# EAGLE schematic unoshield-v3 (EAGLE 8.7.1)
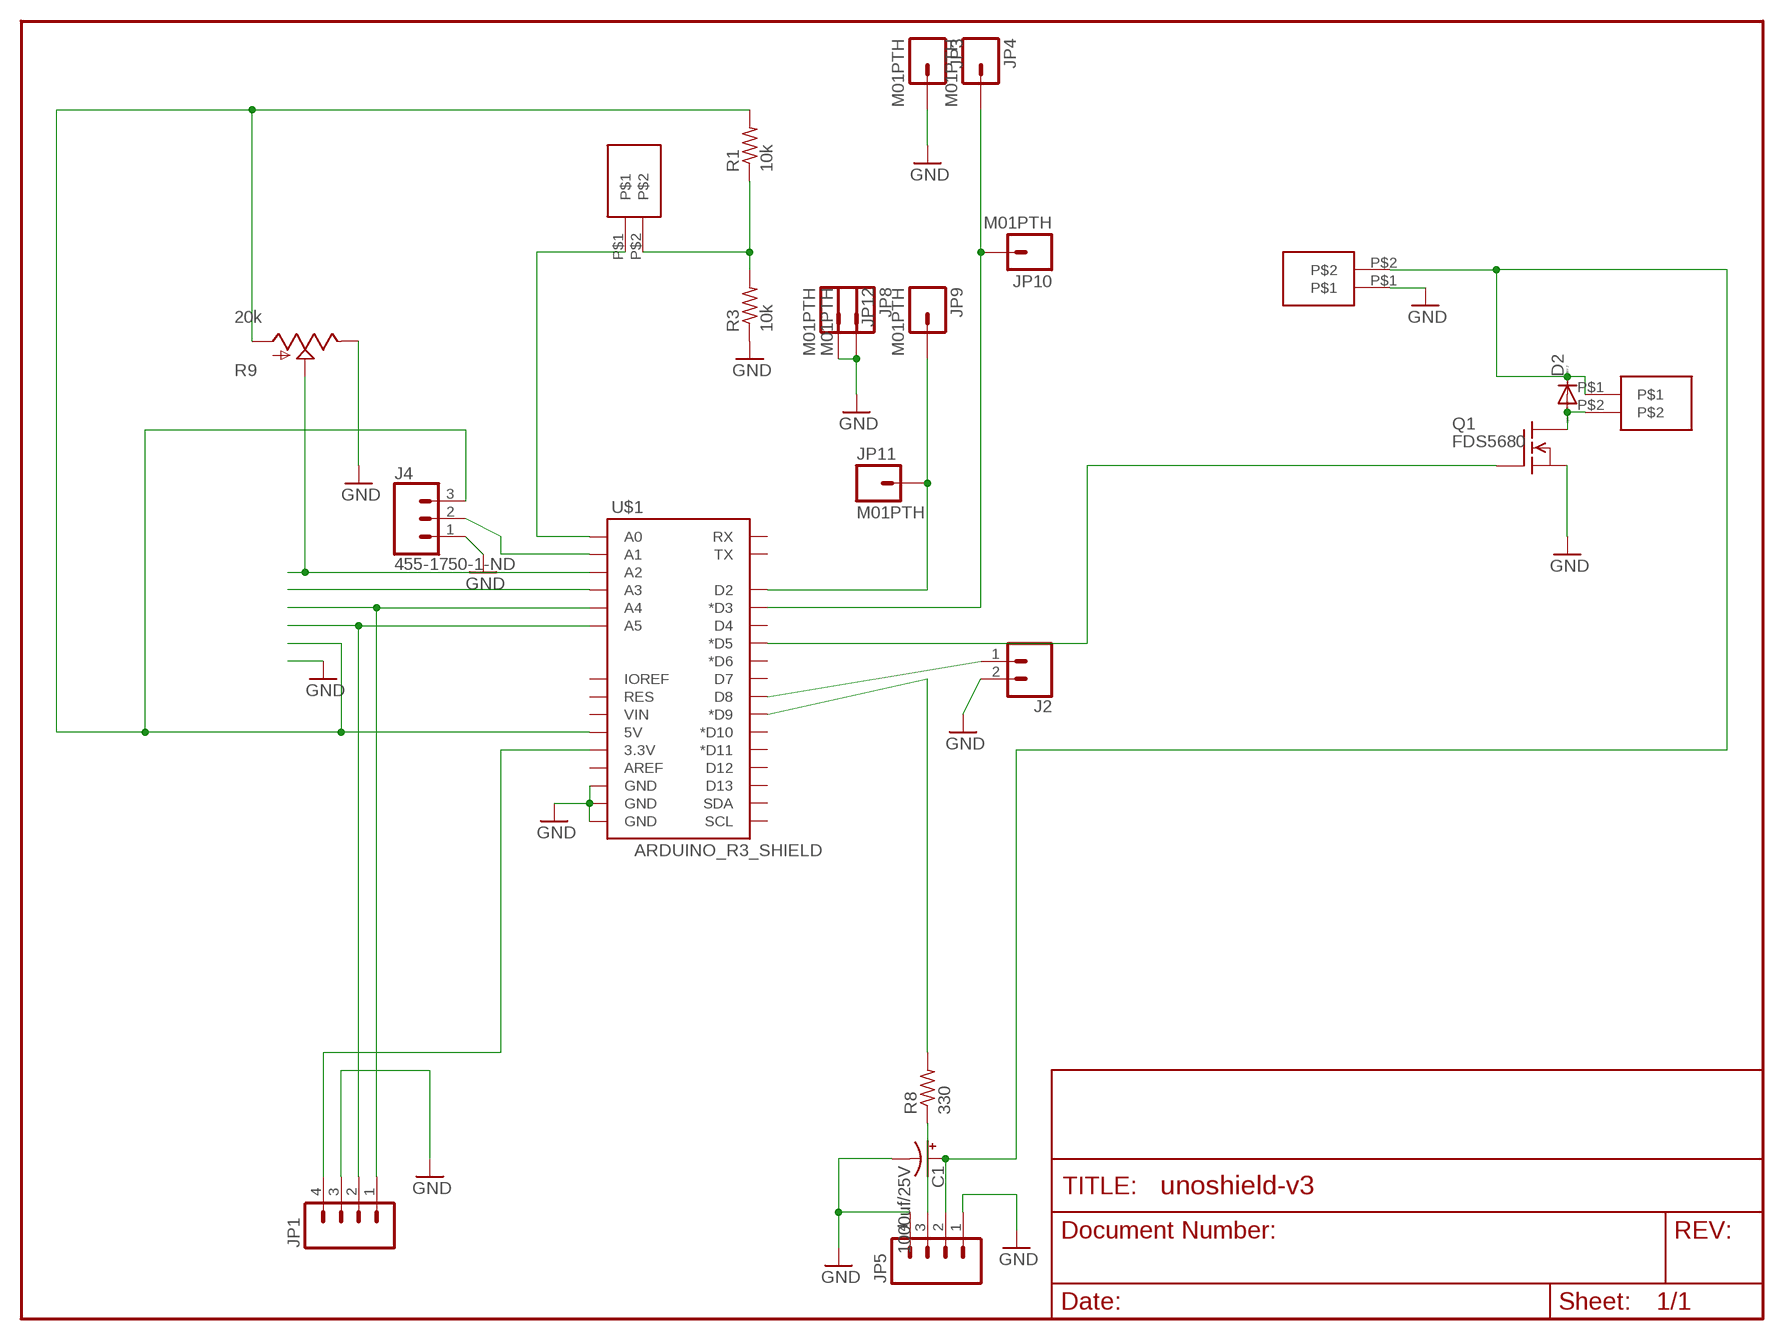
[diagram p0: schematic, sheet 1]

## Parts
C1  1000uf/25V  1000UF-25V(PTH)KIT  [CPOL-RADIAL-1000UF-25V-KIT]
D2  DIODE-DO-214AC  [DO-214AC]
J2  CONN_02  [1X02]
J4  455-1750-1-ND  CONN_03  [1X03]
JP1  M04PTH  [1X04]
JP3  M01PTH  [1X01]
JP4  M01PTH  [1X01]
JP5  M04PTH  [1X04]
JP8  M01PTH  [1X01]
JP9  M01PTH  [1X01]
JP10  M01PTH  [1X01]
JP11  M01PTH  [1X01]
JP12  M01PTH  [1X01]
Q1  FDS5680  [SO-8]
R1  10k  R-US_R0603  [R0603]
R3  10k  R-US_R0603  [R0603]
R8  330  R-US_R0603  [R0603]
R9  20k  POTALPS-KIT  [ALPS_POT_KIT]
U$1  ARDUINO_R3_SHIELD  [UNO_R3_SHIELD]
U$6  SPRING-TERMINAL  [SPRING-TERMINAL]
X1  SPRING-TERMINAL  [SPRING-TERMINAL]
X2  SPRING-TERMINAL  [SPRING-TERMINAL]

## Nets
5V: J4.3 R1.2 R9.P$3(A) U$1.5V
BUTTON: JP4.1 JP10.1 U$1.D3(*D3)
CL: JP1.2 U$1.A5
DA: JP1.1 U$1.A4
GND: C1.- J2.2 J4.1 JP1.3 JP3.1 JP5.1 JP5.4 JP8.1 JP12.1 Q1.1(S) Q1.2(S) Q1.3(S) R3.1 R9.P$1(E) U$1.GND@0(GND) U$1.GND@1(GND) U$1.GND@2(GND) X1.P$1
N$1: Q1.4(G) U$1.D5(*D5)
N$4: R8.2 U$1.D9(*D9)
N$5: R1.1 R3.2 X2.P$2
N$6: J4.2 U$1.A1
N$8: D2.A Q1.5(D) Q1.6(D) Q1.7(D) Q1.8(D) U$6.P$2
N$12: JP9.1 JP11.1 U$1.D2
N$13: J2.1 U$1.D8
N$14: U$1.A3
N$23: U$1.A0 X2.P$1
N$25: JP5.3 R8.1
N$28: R9.P$2(S) U$1.A2
VCC: JP1.4 U$1.3.3V
VIN: C1.+ D2.C JP5.2 U$6.P$1 X1.P$2
Unconnected: U$1.AREF U$1.D4 U$1.D6(*D6) U$1.D7 U$1.D10(*D10) U$1.D11(*D11) U$1.D12 U$1.D13 U$1.IOREF U$1.RES U$1.RX U$1.SCL U$1.SDA U$1.TX U$1.VIN

## Library data of the parts
C1 = SparkFun-Capacitors:1000UF-25V(PTH): CAP-08070; PROD_ID: CAP-09538
D2 = diode:DIODE-: DIODE
J2 = SparkFun-Connectors:CONN_02: Multi connection point. Often used as Generic Header-pin footprint for 0.1 inch spaced/style header connections On any of the 0.1 inch spaced packages, you can populate with these: Break Away Headers - Straight <https://www.sparkfun.com/products/116> (PRT-00116) Break Away Male Headers - Right Angle <https://www.sparkfun.com/products/553> (PRT-00553) Female Headers <https://www.sparkfun.com/products/115> (PRT-00115) Break Away Headers - Machine Pin <https://www.sparkfun.com/products/117> (PRT-00117) Break Away Female Headers - Swiss Machine Pin <https://www.sparkfun.com/products/743> (PRT-00743) For SCREWTERMINALS and SPRING TERMINALS visit here: Screw Terimnals on SparkFun.com <https://www.sparkfun.com/search/results?term=Screw+Terminals> (5mm/3.5mm/2.54mm spacing) This device is also useful as a general connection point to wire up your design to another part of your project. Our various solder wires solder well into these plated through hole pads. Hook-Up Wire - Assortment (Stranded, 22 AWG) <https://www.sparkfun.com/products/11375> (PRT-11375) Hook-Up Wire - Assortment (Solid Core, 22 AWG) <https://www.sparkfun.com/products/11367> (PRT-11367) View the entire wire category on our website here <https://www.sparkfun.com/categories/141> Special notes: Molex polarized connector foot print use with: PRT-08233 with associated crimp pins and housings. 2.54_SCREWTERM for use with PRT-10571. 3.5mm Screw Terminal footprints for PRT-08084 5mm Screw Terminal footprints for use with PRT-08432
J4 = SparkFun-Connectors:CONN_03: Multi connection point. Often used as Generic Header-pin footprint for 0.1 inch spaced/style header connections On any of the 0.1 inch spaced packages, you can populate with these: Break Away Headers - Straight <https://www.sparkfun.com/products/116> (PRT-00116) Break Away Male Headers - Right Angle <https://www.sparkfun.com/products/553> (PRT-00553) Female Headers <https://www.sparkfun.com/products/115> (PRT-00115) Break Away Headers - Machine Pin <https://www.sparkfun.com/products/117> (PRT-00117) Break Away Female Headers - Swiss Machine Pin <https://www.sparkfun.com/products/743> (PRT-00743) Stackable Header - 3 Pin (Female, 0.1") <https://www.sparkfun.com/products/13875> (PRT-13875) For SCREWTERMINALS and SPRING TERMINALS visit here: Screw Terimnals on SparkFun.com <https://www.sparkfun.com/search/results?term=Screw+Terminals> (5mm/3.5mm/2.54mm spacing) This device is also useful as a general connection point to wire up your design to another part of your project. Our various solder wires solder well into these plated through hole pads. Hook-Up Wire - Assortment (Stranded, 22 AWG) <https://www.sparkfun.com/products/11375> (PRT-11375) Hook-Up Wire - Assortment (Solid Core, 22 AWG) <https://www.sparkfun.com/products/11367> (PRT-11367) View the entire wire category on our website here <https://www.sparkfun.com/categories/141> Special notes: Molex polarized connector foot print use with SKU : PRT-08232 with associated crimp pins and housings.; PROD_ID: XXX-00000
JP1 JP5 = SparkFun-Connectors:M04: Header 4 Standard 4-pin 0.1" header. Use with straight break away headers (SKU : PRT-00116), right angle break away headers (PRT-00553), swiss pins (PRT-00743), machine pins (PRT-00117), and female headers (PRT-00115). Molex polarized connector foot print use with SKU : PRT-08231 with associated crimp pins and housings. 1MM SMD Version SKU: PRT-10208
JP3 JP4 JP8-JP12 = SparkFun-Connectors:M01: Header 1 Standard 1-pin 0.1" header. Use with straight break away headers (SKU : PRT-00116), right angle break away headers (PRT-00553), swiss pins (PRT-00743), machine pins (PRT-00117), and female headers (PRT-00115).
Q1 = transistor-fet:FDS5680: 60V N-Channel PowerTrench TM MOSFET FAIRCHILD FDS5680.pdf
R1 R3 R8 = resistor:R-US_: RESISTOR, American symbol
R9 = SparkFun-Electromechanical:POT
U$1 = SparkFun-Boards:ARDUINO_R3_SHIELD: Shield form compatible with the Arduino Uno R3.
U$6 X1 X2 = spietz-library:SPRING-TERMINAL

## Net classes
0 default: width 0.203 mm
1 vcc: width 0.254 mm